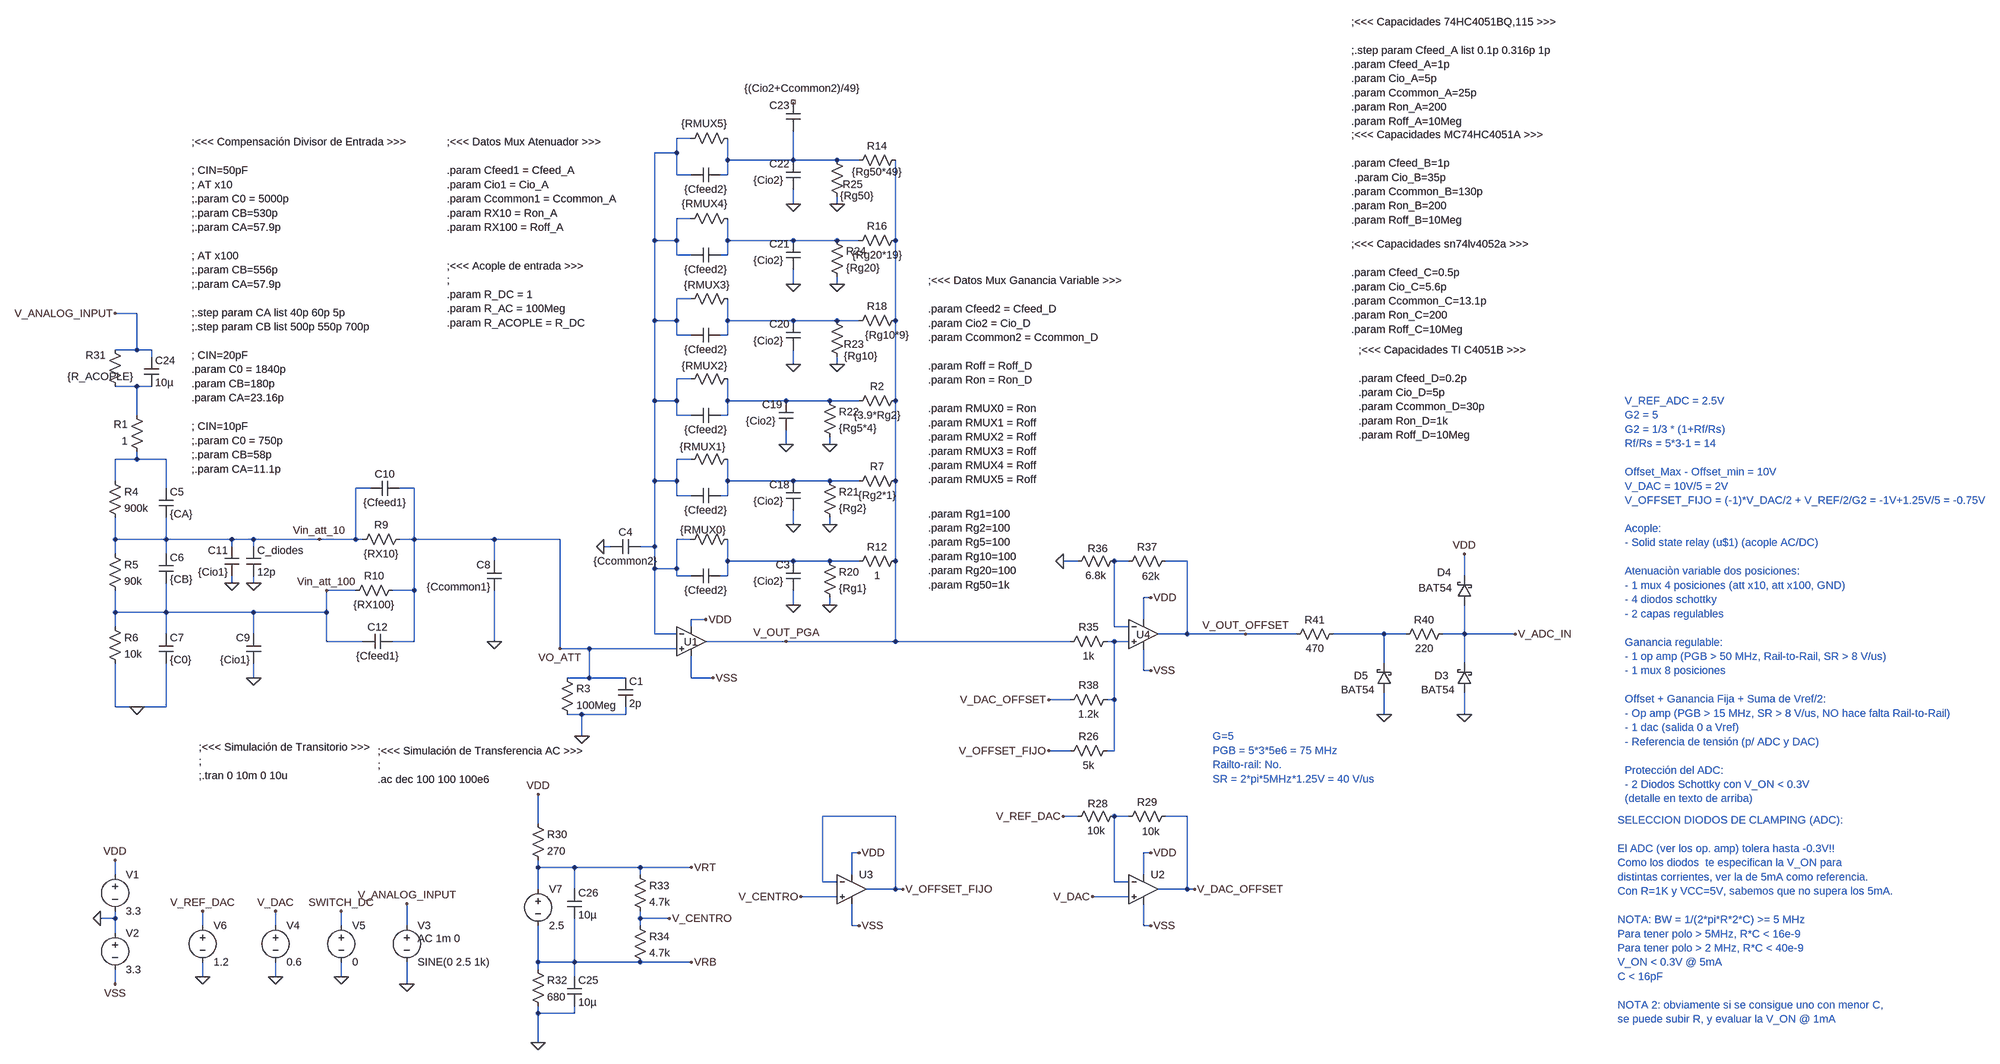
[diagram p0: schematic input_stage_complete.asc]
input_stage_complete.asc, the LTspice schematic file:
Version 4
SHEET 1 3268 1916
WIRE -32 -544 -64 -544
WIRE -64 -512 -64 -544
WIRE -64 -512 -112 -512
WIRE 48 -496 48 -544
WIRE 192 -496 192 -560
WIRE 192 -496 48 -496
WIRE 288 -496 192 -496
WIRE 336 -496 288 -496
WIRE -64 -464 -64 -512
WIRE -32 -464 -64 -464
WIRE 48 -464 48 -496
WIRE 48 -464 32 -464
WIRE 192 -400 192 -432
WIRE 288 -400 288 -416
WIRE -32 -368 -64 -368
WIRE -112 -320 -112 -512
WIRE -64 -320 -64 -368
WIRE -64 -320 -112 -320
WIRE 48 -320 48 -368
WIRE 192 -320 48 -320
WIRE 288 -320 192 -320
WIRE 336 -320 288 -320
WIRE 416 -320 416 -496
WIRE -64 -288 -64 -320
WIRE -32 -288 -64 -288
WIRE 48 -288 48 -320
WIRE 48 -288 32 -288
WIRE 192 -224 192 -256
WIRE 288 -224 288 -240
WIRE -32 -192 -64 -192
WIRE -1248 -160 -1296 -160
WIRE -112 -144 -112 -320
WIRE -64 -144 -64 -192
WIRE -64 -144 -112 -144
WIRE 48 -144 48 -192
WIRE 192 -144 48 -144
WIRE 288 -144 192 -144
WIRE 336 -144 288 -144
WIRE 416 -144 416 -320
WIRE -64 -112 -64 -144
WIRE -32 -112 -64 -112
WIRE 48 -112 48 -144
WIRE 48 -112 32 -112
WIRE -1248 -80 -1248 -160
WIRE -1248 -80 -1296 -80
WIRE -1216 -80 -1248 -80
WIRE -1216 -64 -1216 -80
WIRE 192 -48 192 -80
WIRE 288 -48 288 -64
WIRE -32 -16 -64 -16
WIRE -1248 0 -1296 0
WIRE -1216 0 -1248 0
WIRE -112 32 -112 -144
WIRE -64 32 -64 -16
WIRE -64 32 -112 32
WIRE 48 32 48 -16
WIRE 176 32 48 32
WIRE 272 32 176 32
WIRE 336 32 272 32
WIRE 416 32 416 -144
WIRE -1248 64 -1248 0
WIRE -64 64 -64 32
WIRE -32 64 -64 64
WIRE 48 64 48 32
WIRE 48 64 32 64
WIRE 176 128 176 96
WIRE 272 128 272 112
WIRE -1248 160 -1248 144
WIRE -1248 160 -1296 160
WIRE -1184 160 -1248 160
WIRE -32 160 -64 160
WIRE -1296 208 -1296 160
WIRE -112 208 -112 32
WIRE -64 208 -64 160
WIRE -64 208 -112 208
WIRE 48 208 48 160
WIRE 192 208 48 208
WIRE 272 208 192 208
WIRE 336 208 272 208
WIRE 416 208 416 32
WIRE -1184 224 -1184 160
WIRE -736 224 -768 224
WIRE -640 224 -672 224
WIRE -64 240 -64 208
WIRE -32 240 -64 240
WIRE 48 240 48 208
WIRE 48 240 32 240
WIRE 192 304 192 272
WIRE 272 304 272 288
WIRE -1296 336 -1296 288
WIRE -1184 336 -1184 288
WIRE -1184 336 -1296 336
WIRE -1040 336 -1184 336
WIRE -992 336 -1040 336
WIRE -848 336 -992 336
WIRE -768 336 -768 224
WIRE -768 336 -848 336
WIRE -752 336 -768 336
WIRE -640 336 -640 224
WIRE -640 336 -672 336
WIRE -464 336 -640 336
WIRE -320 336 -464 336
WIRE -32 336 -64 336
WIRE -1040 352 -1040 336
WIRE -992 352 -992 336
WIRE -208 352 -224 352
WIRE -112 352 -112 208
WIRE -112 352 -144 352
WIRE -1296 368 -1296 336
WIRE -1184 368 -1184 336
WIRE -464 384 -464 336
WIRE 48 384 48 336
WIRE 192 384 48 384
WIRE 272 384 192 384
WIRE 336 384 272 384
WIRE 416 384 416 208
WIRE 816 384 784 384
WIRE 928 384 896 384
WIRE 1056 384 1008 384
WIRE -112 400 -112 352
WIRE -64 400 -64 336
WIRE -64 400 -112 400
WIRE -64 416 -64 400
WIRE -32 416 -64 416
WIRE 48 416 48 384
WIRE 48 416 32 416
WIRE 1664 416 1664 368
WIRE -1040 432 -1040 416
WIRE -992 432 -992 416
WIRE -768 448 -832 448
WIRE -640 448 -640 336
WIRE -640 448 -688 448
WIRE 976 464 960 464
WIRE 192 480 192 448
WIRE 272 480 272 464
WIRE -1296 496 -1296 448
WIRE -1184 496 -1184 432
WIRE -1184 496 -1296 496
WIRE -992 496 -1184 496
WIRE -832 496 -832 448
WIRE -832 496 -992 496
WIRE 0 512 -32 512
WIRE 960 512 960 464
WIRE -1296 528 -1296 496
WIRE -32 528 -32 512
WIRE 896 528 896 384
WIRE 928 528 896 528
WIRE -1184 544 -1184 496
WIRE -992 544 -992 496
WIRE -112 544 -112 400
WIRE -64 544 -112 544
WIRE 1056 544 1056 384
WIRE 1056 544 992 544
WIRE 1184 544 1056 544
WIRE 1296 544 1184 544
WIRE 1488 544 1376 544
WIRE 1536 544 1488 544
WIRE 1664 544 1664 480
WIRE 1664 544 1616 544
WIRE 1776 544 1664 544
WIRE -832 560 -832 496
WIRE -752 560 -832 560
WIRE -640 560 -640 448
WIRE -640 560 -688 560
WIRE -464 560 -464 448
WIRE 176 560 0 560
WIRE 416 560 416 384
WIRE 416 560 176 560
WIRE 800 560 416 560
WIRE 896 560 880 560
WIRE 928 560 896 560
WIRE -320 576 -320 336
WIRE -256 576 -320 576
WIRE -64 576 -256 576
WIRE 1488 608 1488 544
WIRE 1664 608 1664 544
WIRE 960 624 960 576
WIRE 976 624 960 624
WIRE -992 640 -992 608
WIRE -256 640 -256 576
WIRE -256 640 -304 640
WIRE -176 640 -256 640
WIRE -32 640 -32 592
WIRE 16 640 -32 640
WIRE 800 688 752 688
WIRE 896 688 896 560
WIRE 896 688 880 688
WIRE -1296 704 -1296 608
WIRE -1248 704 -1296 704
WIRE -1184 704 -1184 608
WIRE -1184 704 -1248 704
WIRE -272 720 -304 720
WIRE -176 720 -176 704
WIRE -176 720 -272 720
WIRE 1488 720 1488 672
WIRE 1664 720 1664 672
WIRE -272 768 -272 720
WIRE 800 800 752 800
WIRE 896 800 896 688
WIRE 896 800 880 800
WIRE 416 944 256 944
WIRE 816 944 784 944
WIRE 928 944 896 944
WIRE 1056 944 1008 944
WIRE -368 960 -368 896
WIRE 336 1024 320 1024
WIRE 976 1024 960 1024
WIRE -368 1056 -368 1040
WIRE -288 1056 -368 1056
WIRE -144 1056 -288 1056
WIRE -32 1056 -144 1056
WIRE -1296 1072 -1296 1040
WIRE -144 1072 -144 1056
WIRE 320 1072 320 1024
WIRE 960 1072 960 1024
WIRE 256 1088 256 944
WIRE 288 1088 256 1088
WIRE 896 1088 896 944
WIRE 928 1088 896 1088
WIRE -368 1104 -368 1056
WIRE -288 1104 -288 1056
WIRE 416 1104 416 944
WIRE 416 1104 352 1104
WIRE 432 1104 416 1104
WIRE 1056 1104 1056 944
WIRE 1056 1104 992 1104
WIRE 1072 1104 1056 1104
WIRE 288 1120 208 1120
WIRE 928 1120 848 1120
WIRE -1296 1168 -1296 1152
WIRE -1296 1168 -1328 1168
WIRE -144 1168 -144 1152
WIRE -80 1168 -144 1168
WIRE -1104 1184 -1104 1152
WIRE -944 1184 -944 1152
WIRE -800 1184 -800 1152
WIRE -656 1184 -656 1136
WIRE -144 1184 -144 1168
WIRE 320 1184 320 1136
WIRE 336 1184 320 1184
WIRE 960 1184 960 1136
WIRE 976 1184 960 1184
WIRE -1296 1200 -1296 1168
WIRE -368 1264 -368 1184
WIRE -288 1264 -288 1168
WIRE -288 1264 -368 1264
WIRE -144 1264 -288 1264
WIRE -32 1264 -144 1264
WIRE -368 1280 -368 1264
WIRE -1104 1296 -1104 1264
WIRE -944 1296 -944 1264
WIRE -800 1296 -800 1264
WIRE -288 1296 -288 1264
WIRE -1296 1312 -1296 1280
WIRE -656 1312 -656 1264
WIRE -368 1376 -368 1360
WIRE -288 1376 -288 1360
WIRE -288 1376 -368 1376
WIRE -368 1440 -368 1376
FLAG 16 640 VSS
FLAG -272 768 0
FLAG 272 480 0
FLAG 0 512 VDD
FLAG -1328 1168 0
FLAG -1296 1040 VDD
FLAG -1296 1312 VSS
FLAG -656 1136 V_ANALOG_INPUT
FLAG -656 1312 0
FLAG 176 560 V_OUT_PGA
FLAG -224 352 0
FLAG 192 480 0
FLAG -1248 704 0
FLAG -1296 -160 V_ANALOG_INPUT
FLAG -464 560 0
FLAG -1040 432 0
FLAG -848 336 Vin_att_10
FLAG -832 448 Vin_att_100
FLAG -992 640 0
FLAG -320 576 VO_ATT
FLAG -992 432 0
FLAG 272 304 0
FLAG 272 128 0
FLAG 288 -48 0
FLAG 288 -224 0
FLAG 288 -400 0
FLAG 192 304 0
FLAG 176 128 0
FLAG 192 -48 0
FLAG 192 -224 0
FLAG 192 -400 0
FLAG -944 1152 V_DAC
FLAG -944 1296 0
FLAG -800 1152 SWITCH_DC
FLAG -800 1296 0
FLAG -1104 1152 V_REF_DAC
FLAG -1104 1296 0
FLAG 752 688 V_DAC_OFFSET
FLAG 976 464 VDD
FLAG 976 624 VSS
FLAG 1072 1104 V_DAC_OFFSET
FLAG 976 1024 VDD
FLAG 976 1184 VSS
FLAG 784 944 V_REF_DAC
FLAG 752 800 V_OFFSET_FIJO
FLAG 784 384 0
FLAG 848 1120 V_DAC
FLAG -368 896 VDD
FLAG 432 1104 V_OFFSET_FIJO
FLAG 336 1024 VDD
FLAG 336 1184 VSS
FLAG -368 1440 0
FLAG -32 1264 VRB
FLAG -32 1056 VRT
FLAG 208 1120 V_CENTRO
FLAG -80 1168 V_CENTRO
FLAG 1184 544 V_OUT_OFFSET
FLAG 1664 368 VDD
FLAG 1664 720 0
FLAG 1776 544 V_ADC_IN
FLAG 1488 720 0
SYMBOL res 432 16 R90
WINDOW 0 0 56 VBottom 2
WINDOW 3 32 56 VTop 2
SYMATTR InstName R2
SYMATTR Value {3.9*Rg2}
SYMBOL cap -192 640 R0
SYMATTR InstName C1
SYMATTR Value 2p
SYMBOL res -320 624 R0
SYMATTR InstName R3
SYMATTR Value 100Meg
SYMBOL voltage -1296 1056 R0
WINDOW 123 0 0 Left 2
WINDOW 39 0 0 Left 2
SYMATTR InstName V1
SYMATTR Value 3.3
SYMBOL voltage -1296 1184 R0
WINDOW 123 0 0 Left 2
WINDOW 39 0 0 Left 2
SYMATTR InstName V2
SYMATTR Value 3.3
SYMBOL voltage -656 1168 R0
WINDOW 123 24 44 Left 2
WINDOW 39 0 0 Left 2
SYMATTR Value2 AC 1m 0
SYMATTR InstName V3
SYMATTR Value SINE(0 2.5 1k)
SYMBOL Opamps\\UniversalOpamp2 -32 560 R0
WINDOW 0 -16 1 Left 2
SYMATTR InstName U1
SYMATTR Value2 Avol=40k GBW=250Meg Slew=100Meg
SYMBOL cap 32 48 R90
WINDOW 0 0 32 Invisible 2
WINDOW 3 32 32 VTop 2
SYMATTR InstName C2
SYMATTR Value {Cfeed2}
SYMBOL cap -144 336 R90
WINDOW 0 0 32 VBottom 2
WINDOW 3 32 32 VTop 2
SYMATTR InstName C4
SYMATTR Value {Ccommon2}
SYMBOL cap 208 448 R180
WINDOW 0 24 56 Left 2
WINDOW 3 38 20 Left 2
SYMATTR InstName C3
SYMATTR Value {Cio2}
SYMBOL res -1312 192 R0
SYMATTR InstName R4
SYMATTR Value 900k
SYMBOL res -1312 352 R0
SYMATTR InstName R5
SYMATTR Value 90k
SYMBOL res -1312 512 R0
SYMATTR InstName R6
SYMATTR Value 10k
SYMBOL cap -1200 224 R0
SYMATTR InstName C5
SYMATTR Value {CA}
SYMBOL cap -1200 368 R0
SYMATTR InstName C6
SYMATTR Value {CB}
SYMBOL cap -1200 544 R0
SYMATTR InstName C7
SYMATTR Value {C0}
SYMBOL res 64 -32 R90
WINDOW 0 0 56 Invisible 2
WINDOW 3 -28 67 VTop 2
SYMATTR InstName R8
SYMATTR Value {RMUX2}
SYMBOL cap -448 448 R180
WINDOW 0 24 56 Left 2
WINDOW 3 24 8 Left 2
SYMATTR InstName C8
SYMATTR Value {Ccommon1}
SYMBOL cap -672 208 R90
WINDOW 0 0 32 VBottom 2
WINDOW 3 32 32 VTop 2
SYMATTR InstName C10
SYMATTR Value {Cfeed1}
SYMBOL cap -1024 416 R180
WINDOW 0 24 56 Left 2
WINDOW 3 24 8 Left 2
SYMATTR InstName C11
SYMATTR Value {Cio1}
SYMBOL cap -976 608 R180
WINDOW 0 24 56 Left 2
WINDOW 3 24 8 Left 2
SYMATTR InstName C9
SYMATTR Value {Cio1}
SYMBOL res -656 320 R90
WINDOW 0 0 56 VBottom 2
WINDOW 3 32 56 VTop 2
SYMATTR InstName R9
SYMATTR Value {RX10}
SYMBOL res -672 432 R90
WINDOW 0 0 56 VBottom 2
WINDOW 3 32 56 VTop 2
SYMATTR InstName R10
SYMATTR Value {RX100}
SYMBOL cap -688 544 R90
WINDOW 0 0 32 VBottom 2
WINDOW 3 32 32 VTop 2
SYMATTR InstName C12
SYMATTR Value {Cfeed1}
SYMBOL res 432 192 R90
WINDOW 0 0 56 VBottom 2
WINDOW 3 32 56 VTop 2
SYMATTR InstName R7
SYMATTR Value {Rg2*1}
SYMBOL cap 32 224 R90
WINDOW 0 0 32 Invisible 2
WINDOW 3 32 32 VTop 2
SYMATTR InstName C13
SYMATTR Value {Cfeed2}
SYMBOL res 64 144 R90
WINDOW 0 0 56 Invisible 2
WINDOW 3 -27 71 VTop 2
SYMATTR InstName R11
SYMATTR Value {RMUX1}
SYMBOL res 432 368 R90
WINDOW 0 0 56 VBottom 2
WINDOW 3 32 56 VTop 2
SYMATTR InstName R12
SYMATTR Value 1
SYMBOL cap 32 400 R90
WINDOW 0 0 32 Invisible 2
WINDOW 3 32 32 VTop 2
SYMATTR InstName C14
SYMATTR Value {Cfeed2}
SYMBOL res 64 320 R90
WINDOW 0 0 56 Invisible 2
WINDOW 3 -20 70 VTop 2
SYMATTR InstName R13
SYMATTR Value {RMUX0}
SYMBOL res 432 -512 R90
WINDOW 0 0 56 VBottom 2
WINDOW 3 26 57 VTop 2
SYMATTR InstName R14
SYMATTR Value {Rg50*49}
SYMBOL cap 32 -480 R90
WINDOW 0 0 32 Invisible 2
WINDOW 3 32 32 VTop 2
SYMATTR InstName C15
SYMATTR Value {Cfeed2}
SYMBOL res 64 -560 R90
WINDOW 0 0 56 Invisible 2
WINDOW 3 -32 68 VTop 2
SYMATTR InstName R15
SYMATTR Value {RMUX5}
SYMBOL res 432 -336 R90
WINDOW 0 0 56 VBottom 2
WINDOW 3 32 56 VTop 2
SYMATTR InstName R16
SYMATTR Value {Rg20*19}
SYMBOL cap 32 -304 R90
WINDOW 0 0 32 Invisible 2
WINDOW 3 32 32 VTop 2
SYMATTR InstName C16
SYMATTR Value {Cfeed2}
SYMBOL res 64 -384 R90
WINDOW 0 0 56 Invisible 2
WINDOW 3 -32 67 VTop 2
SYMATTR InstName R17
SYMATTR Value {RMUX4}
SYMBOL res 432 -160 R90
WINDOW 0 0 56 VBottom 2
WINDOW 3 32 34 VTop 2
SYMATTR InstName R18
SYMATTR Value {Rg10*9}
SYMBOL cap 32 -128 R90
WINDOW 0 0 32 Invisible 2
WINDOW 3 32 32 VTop 2
SYMATTR InstName C17
SYMATTR Value {Cfeed2}
SYMBOL res 64 -208 R90
WINDOW 0 0 56 Invisible 2
WINDOW 3 -30 62 VTop 2
SYMATTR InstName R19
SYMATTR Value {RMUX3}
SYMBOL cap -1008 352 R0
SYMATTR InstName C_diodes
SYMATTR Value 12p
SYMBOL res 256 368 R0
SYMATTR InstName R20
SYMATTR Value {Rg1}
SYMBOL res 256 192 R0
SYMATTR InstName R21
SYMATTR Value {Rg2}
SYMBOL res 256 16 R0
SYMATTR InstName R22
SYMATTR Value {Rg5*4}
SYMBOL res 272 -160 R0
WINDOW 0 31 68 Left 2
WINDOW 3 31 94 Left 2
SYMATTR InstName R23
SYMATTR Value {Rg10}
SYMBOL res 272 -336 R0
SYMATTR InstName R24
SYMATTR Value {Rg20}
SYMBOL res 272 -512 R0
WINDOW 0 28 69 Left 2
WINDOW 3 22 94 Left 2
SYMATTR InstName R25
SYMATTR Value {Rg50}
SYMBOL cap 208 272 R180
WINDOW 0 24 56 Left 2
WINDOW 3 38 20 Left 2
SYMATTR InstName C18
SYMATTR Value {Cio2}
SYMBOL cap 192 96 R180
WINDOW 0 24 56 Left 2
WINDOW 3 38 20 Left 2
SYMATTR InstName C19
SYMATTR Value {Cio2}
SYMBOL cap 208 -80 R180
WINDOW 0 24 56 Left 2
WINDOW 3 38 20 Left 2
SYMATTR InstName C20
SYMATTR Value {Cio2}
SYMBOL cap 208 -256 R180
WINDOW 0 24 56 Left 2
WINDOW 3 38 20 Left 2
SYMATTR InstName C21
SYMATTR Value {Cio2}
SYMBOL cap 208 -432 R180
WINDOW 0 24 56 Left 2
WINDOW 3 38 20 Left 2
SYMATTR InstName C22
SYMATTR Value {Cio2}
SYMBOL cap 208 -560 R180
WINDOW 0 24 56 Left 2
WINDOW 3 -131 94 Left 2
SYMATTR InstName C23
SYMATTR Value {(Cio2+Ccommon2)/49}
SYMBOL res -1232 160 R180
WINDOW 0 36 76 Left 2
WINDOW 3 36 40 Left 2
SYMATTR InstName R1
SYMATTR Value 1
SYMBOL voltage -944 1168 R0
WINDOW 123 0 0 Left 2
WINDOW 39 0 0 Left 2
SYMATTR InstName V4
SYMATTR Value 0.6
SYMBOL voltage -800 1168 R0
WINDOW 123 0 0 Left 2
WINDOW 39 0 0 Left 2
SYMATTR InstName V5
SYMATTR Value 0
SYMBOL voltage -1104 1168 R0
WINDOW 123 0 0 Left 2
WINDOW 39 0 0 Left 2
SYMATTR InstName V6
SYMATTR Value 1.2
SYMBOL cap -1232 -64 R0
SYMATTR InstName C24
SYMATTR Value 10µ
SYMBOL res -1312 -96 R0
WINDOW 0 -49 28 Left 2
WINDOW 3 -89 75 Left 2
SYMATTR InstName R31
SYMATTR Value {R_ACOPLE}
SYMBOL res 784 576 R270
WINDOW 0 32 56 VTop 2
WINDOW 3 0 56 VBottom 2
SYMATTR InstName R35
SYMATTR Value 1k
SYMBOL res 800 400 R270
WINDOW 0 28 60 VTop 2
WINDOW 3 0 56 VBottom 2
SYMATTR InstName R36
SYMATTR Value 6.8k
SYMBOL res 912 400 R270
WINDOW 0 32 56 VTop 2
WINDOW 3 -1 64 VBottom 2
SYMATTR InstName R37
SYMATTR Value 62k
SYMBOL res 784 704 R270
WINDOW 0 32 56 VTop 2
WINDOW 3 0 56 VBottom 2
SYMATTR InstName R38
SYMATTR Value 1.2k
SYMBOL res 800 960 R270
WINDOW 0 28 60 VTop 2
WINDOW 3 0 56 VBottom 2
SYMATTR InstName R28
SYMATTR Value 10k
SYMBOL res 912 960 R270
WINDOW 0 32 56 VTop 2
WINDOW 3 -1 64 VBottom 2
SYMATTR InstName R29
SYMATTR Value 10k
SYMBOL Opamps\\UniversalOpamp2 960 1104 R0
SYMATTR InstName U2
SYMBOL res 784 816 R270
WINDOW 0 32 56 VTop 2
WINDOW 3 0 56 VBottom 2
SYMATTR InstName R26
SYMATTR Value 5k
SYMBOL Opamps\\UniversalOpamp2 320 1104 R0
SYMATTR InstName U3
SYMBOL res -384 944 R0
SYMATTR InstName R30
SYMATTR Value 270
SYMBOL voltage -368 1088 R0
WINDOW 123 0 0 Left 2
WINDOW 39 0 0 Left 2
SYMATTR InstName V7
SYMATTR Value 2.5
SYMBOL res -384 1264 R0
SYMATTR InstName R32
SYMATTR Value 680
SYMBOL cap -304 1296 R0
SYMATTR InstName C25
SYMATTR Value 10µ
SYMBOL cap -304 1104 R0
SYMATTR InstName C26
SYMATTR Value 10µ
SYMBOL res -160 1056 R0
SYMATTR InstName R33
SYMATTR Value 4.7k
SYMBOL res -160 1168 R0
SYMATTR InstName R34
SYMATTR Value 4.7k
SYMBOL Opamps\\UniversalOpamp2 960 544 R0
WINDOW 0 -16 1 Left 2
SYMATTR InstName U4
SYMATTR Value2 Avol=40k GBW=250Meg Slew=100Meg
SYMBOL res 1520 560 R270
WINDOW 0 32 56 VTop 2
WINDOW 3 0 56 VBottom 2
SYMATTR InstName R40
SYMATTR Value 220
SYMBOL schottky 1680 672 R180
WINDOW 0 51 37 Left 2
WINDOW 3 37 6 Left 2
SYMATTR InstName D3
SYMATTR Value BAT54
SYMBOL schottky 1680 480 R180
WINDOW 0 45 71 Left 2
WINDOW 3 43 37 Left 2
SYMATTR InstName D4
SYMATTR Value BAT54
SYMBOL res 1280 560 R270
WINDOW 0 32 56 VTop 2
WINDOW 3 0 56 VBottom 2
SYMATTR InstName R41
SYMATTR Value 470
SYMBOL schottky 1504 672 R180
WINDOW 0 51 37 Left 2
WINDOW 3 37 6 Left 2
SYMATTR InstName D5
SYMATTR Value BAT54
TEXT 1416 -312 Left 2 !;<<< Capacidades sn74lv4052a >>>\n \n.param Cfeed_C=0.5p\n.param Cio_C=5.6p\n.param Ccommon_C=13.1p\n.param Ron_C=200\n.param Roff_C=10Meg
TEXT -568 -536 Left 2 !;<<< Datos Mux Atenuador >>>\n \n.param Cfeed1 = Cfeed_A\n.param Cio1 = Cio_A\n.param Ccommon1 = Ccommon_A\n.param RX10 = Ron_A\n.param RX100 = Roff_A
TEXT 1416 -552 Left 2 !;<<< Capacidades MC74HC4051A >>>\n \n.param Cfeed_B=1p\n .param Cio_B=35p\n.param Ccommon_B=130p\n.param Ron_B=200\n.param Roff_B=10Meg
TEXT 488 -232 Left 2 !;<<< Datos Mux Ganancia Variable >>>\n \n.param Cfeed2 = Cfeed_D\n.param Cio2 = Cio_D\n.param Ccommon2 = Ccommon_D\n \n.param Roff = Roff_D\n.param Ron = Ron_D \n \n.param RMUX0 = Ron\n.param RMUX1 = Roff\n.param RMUX2 = Roff\n.param RMUX3 = Roff\n.param RMUX4 = Roff\n.param RMUX5 = Roff
TEXT -720 800 Left 2 !;<<< Simulación de Transferencia AC >>>\n;\n.ac dec 100 100 100e6
TEXT 1416 -800 Left 2 !;<<< Capacidades 74HC4051BQ,115 >>>\n \n;.step param Cfeed_A list 0.1p 0.316p 1p\n.param Cfeed_A=1p\n.param Cio_A=5p\n.param Ccommon_A=25p\n.param Ron_A=200\n.param Roff_A=10Meg
TEXT 1432 -80 Left 2 !;<<< Capacidades TI C4051B >>>\n \n.param Cfeed_D=0.2p\n.param Cio_D=5p\n.param Ccommon_D=30p\n.param Ron_D=1k\n.param Roff_D=10Meg
TEXT 488 280 Left 2 !.param Rg1=100\n.param Rg2=100\n.param Rg5=100\n.param Rg10=100\n.param Rg20=100\n.param Rg50=1k
TEXT -1128 -536 Left 2 !;<<< Compensación Divisor de Entrada >>>\n \n; CIN=50pF\n; AT x10\n;.param C0 = 5000p\n;.param CB=530p\n;.param CA=57.9p\n \n; AT x100\n;.param CB=556p\n;.param CA=57.9p\n \n;.step param CA list 40p 60p 5p\n;.step param CB list 500p 550p 700p\n \n; CIN=20pF\n.param C0 = 1840p\n.param CB=180p\n.param CA=23.16p\n \n; CIN=10pF\n;.param C0 = 750p\n;.param CB=58p\n;.param CA=11.1p
TEXT -1112 792 Left 2 !;<<< Simulación de Transitorio >>>\n;\n;.tran 0 10m 0 10u
TEXT 2000 952 Left 2 ;SELECCION DIODOS DE CLAMPING (ADC):\n \nEl ADC (ver los op. amp) tolera hasta -0.3V!!\nComo los diodos  te especifican la V_ON para\ndistintas corrientes, ver la de 5mA como referencia.\nCon R=1K y VCC=5V, sabemos que no supera los 5mA.\n \nNOTA: BW = 1/(2*pi*R*2*C) >= 5 MHz\nPara tener polo > 5MHz, R*C < 16e-9\nPara tener polo > 2 MHz, R*C < 40e-9\nV_ON < 0.3V @ 5mA\nC < 16pF\n \nNOTA 2: obviamente si se consigue uno con menor C,\nse puede subir R, y evaluar la V_ON @ 1mA
TEXT 1112 768 Left 2 ;G=5\nPGB = 5*3*5e6 = 75 MHz\nRailto-rail: No.\nSR = 2*pi*5MHz*1.25V = 40 V/us
TEXT 2016 312 Left 2 ;Acople:\n- Solid state relay (u$1) (acople AC/DC)\n \nAtenuaciòn variable dos posiciones:\n- 1 mux 4 posiciones (att x10, att x100, GND)\n- 4 diodos schottky\n- 2 capas regulables\n \nGanancia regulable:\n- 1 op amp (PGB > 50 MHz, Rail-to-Rail, SR > 8 V/us)\n- 1 mux 8 posiciones\n \nOffset + Ganancia Fija + Suma de Vref/2:\n- Op amp (PGB > 15 MHz, SR > 8 V/us, NO hace falta Rail-to-Rail)\n- 1 dac (salida 0 a Vref)\n- Referencia de tensión (p/ ADC y DAC)\n \nProtección del ADC:\n- 2 Diodos Schottky con V_ON < 0.3V\n(detalle en texto de arriba)
TEXT -568 -264 Left 2 !;<<< Acople de entrada >>>\n;\n.param R_DC = 1\n.param R_AC = 100Meg\n.param R_ACOPLE = R_DC
TEXT 2016 32 Left 2 ;V_REF_ADC = 2.5V\nG2 = 5\nG2 = 1/3 * (1+Rf/Rs)\nRf/Rs = 5*3-1 = 14\n \nOffset_Max - Offset_min = 10V\nV_DAC = 10V/5 = 2V\nV_OFFSET_FIJO = (-1)*V_DAC/2 + V_REF/2/G2 = -1V+1.25V/5 = -0.75V

The netlist it stands for:
* input_stage_complete.asc
R2 V_OUT_PGA N006 {3.9*Rg2}
C1 VO_ATT 0 2p
R3 VO_ATT 0 100Meg
V1 VDD 0 3.3
V2 0 VSS 3.3
V3 V_ANALOG_INPUT 0 SINE(0 2.5 1k) AC 1m 0
XU1 VO_ATT N001 VDD VSS V_OUT_PGA level.2 Avol=40k GBW=250Meg Slew=100Meg ilimit=25m rail=0 Vos=0 phimargin=45 en=0 enk=0 in=0 ink=0 Rin=500Meg  ; pins IN+ IN- V+ V- OUT
C2 N006 N001 {Cfeed2}
C4 N001 0 {Ccommon2}
C3 0 N009 {Cio2}
R4 N007 Vin_att_10 900k
R5 Vin_att_10 Vin_att_100 90k
R6 Vin_att_100 0 10k
C5 N007 Vin_att_10 {CA}
C6 Vin_att_10 Vin_att_100 {CB}
C7 Vin_att_100 0 {C0}
R8 N006 N001 {RMUX2}
C8 0 VO_ATT {Ccommon1}
C10 VO_ATT Vin_att_10 {Cfeed1}
C11 0 Vin_att_10 {Cio1}
C9 0 Vin_att_100 {Cio1}
R9 VO_ATT Vin_att_10 {RX10}
R10 VO_ATT Vin_att_100 {RX100}
C12 VO_ATT Vin_att_100 {Cfeed1}
R7 V_OUT_PGA N008 {Rg2*1}
C13 N008 N001 {Cfeed2}
R11 N008 N001 {RMUX1}
R12 V_OUT_PGA N009 1
C14 N009 N001 {Cfeed2}
R13 N009 N001 {RMUX0}
R14 V_OUT_PGA N002 {Rg50*49}
C15 N002 N001 {Cfeed2}
R15 N002 N001 {RMUX5}
R16 V_OUT_PGA N003 {Rg20*19}
C16 N003 N001 {Cfeed2}
R17 N003 N001 {RMUX4}
R18 V_OUT_PGA N004 {Rg10*9}
C17 N004 N001 {Cfeed2}
R19 N004 N001 {RMUX3}
C_diodes Vin_att_10 0 12p
R20 N009 0 {Rg1}
R21 N008 0 {Rg2}
R22 N006 0 {Rg5*4}
R23 N004 0 {Rg10}
R24 N003 0 {Rg20}
R25 N002 0 {Rg50}
C18 0 N008 {Cio2}
C19 0 N006 {Cio2}
C20 0 N004 {Cio2}
C21 0 N003 {Cio2}
C22 0 N002 {Cio2}
C23 N002 NC_01 {(Cio2+Ccommon2)/49}
R1 N007 N005 1
V4 V_DAC 0 0.6
V5 SWITCH_DC 0 0
V6 V_REF_DAC 0 1.2
C24 V_ANALOG_INPUT N005 10µ
R31 V_ANALOG_INPUT N005 {R_ACOPLE}
R35 V_OUT_PGA N012 1k
R36 0 N010 6.8k
R37 N010 V_OUT_OFFSET 62k
R38 V_DAC_OFFSET N012 1.2k
R28 V_REF_DAC N013 10k
R29 N013 V_DAC_OFFSET 10k
XU2 V_DAC N013 VDD VSS V_DAC_OFFSET level.2 Avol=1Meg GBW=10Meg Slew=10Meg ilimit=25m rail=0 Vos=0 phimargin=45 en=0 enk=0 in=0 ink=0 Rin=500Meg  ; pins IN+ IN- V+ V- OUT
R26 V_OFFSET_FIJO N012 5k
XU3 V_CENTRO V_OFFSET_FIJO VDD VSS V_OFFSET_FIJO level.2 Avol=1Meg GBW=10Meg Slew=10Meg ilimit=25m rail=0 Vos=0 phimargin=45 en=0 enk=0 in=0 ink=0 Rin=500Meg  ; pins IN+ IN- V+ V- OUT
R30 VDD VRT 270
V7 VRT VRB 2.5
R32 VRB 0 680
C25 VRB 0 10µ
C26 VRT VRB 10µ
R33 VRT V_CENTRO 4.7k
R34 V_CENTRO VRB 4.7k
XU4 N012 N010 VDD VSS V_OUT_OFFSET level.2 Avol=40k GBW=250Meg Slew=100Meg ilimit=25m rail=0 Vos=0 phimargin=45 en=0 enk=0 in=0 ink=0 Rin=500Meg  ; pins IN+ IN- V+ V- OUT
R40 N011 V_ADC_IN 220
D3 0 V_ADC_IN BAT54
D4 V_ADC_IN VDD BAT54
R41 V_OUT_OFFSET N011 470
D5 0 N011 BAT54
.model D D
.lib standard.dio
;<<< Capacidades sn74lv4052a >>>
.param Cfeed_C=0.5p
.param Cio_C=5.6p
.param Ccommon_C=13.1p
.param Ron_C=200
.param Roff_C=10Meg
;<<< Datos Mux Atenuador >>>
.param Cfeed1 = Cfeed_A
.param Cio1 = Cio_A
.param Ccommon1 = Ccommon_A
.param RX10 = Ron_A
.param RX100 = Roff_A
;<<< Capacidades MC74HC4051A >>>
.param Cfeed_B=1p
 .param Cio_B=35p
.param Ccommon_B=130p
.param Ron_B=200
.param Roff_B=10Meg
;<<< Datos Mux Ganancia Variable >>>
.param Cfeed2 = Cfeed_D
.param Cio2 = Cio_D
.param Ccommon2 = Ccommon_D
.param Roff = Roff_D
.param Ron = Ron_D
.param RMUX0 = Ron
.param RMUX1 = Roff
.param RMUX2 = Roff
.param RMUX3 = Roff
.param RMUX4 = Roff
.param RMUX5 = Roff
;<<< Simulación de Transferencia AC >>>
;
.ac dec 100 100 100e6
;<<< Capacidades 74HC4051BQ,115 >>>
;.step param Cfeed_A list 0.1p 0.316p 1p
.param Cfeed_A=1p
.param Cio_A=5p
.param Ccommon_A=25p
.param Ron_A=200
.param Roff_A=10Meg
;<<< Capacidades TI C4051B >>>
.param Cfeed_D=0.2p
.param Cio_D=5p
.param Ccommon_D=30p
.param Ron_D=1k
.param Roff_D=10Meg
.param Rg1=100
.param Rg2=100
.param Rg5=100
.param Rg10=100
.param Rg20=100
.param Rg50=1k
;<<< Compensación Divisor de Entrada >>>
; CIN=50pF
; AT x10
;.param C0 = 5000p
;.param CB=530p
;.param CA=57.9p
; AT x100
;.param CB=556p
;.param CA=57.9p
;.step param CA list 40p 60p 5p
;.step param CB list 500p 550p 700p
; CIN=20pF
.param C0 = 1840p
.param CB=180p
.param CA=23.16p
; CIN=10pF
;.param C0 = 750p
;.param CB=58p
;.param CA=11.1p
;<<< Simulación de Transitorio >>>
;
;.tran 0 10m 0 10u
* SELECCION DIODOS DE CLAMPING (ADC):
* El ADC (ver los op. amp) tolera hasta -0.3V!!
* Como los diodos  te especifican la V_ON para
* distintas corrientes, ver la de 5mA como referencia.
* Con R=1K y VCC=5V, sabemos que no supera los 5mA.
* NOTA: BW = 1/(2*pi*R*2*C) >= 5 MHz
* Para tener polo > 5MHz, R*C < 16e-9
* Para tener polo > 2 MHz, R*C < 40e-9
* V_ON < 0.3V @ 5mA
* C < 16pF
* NOTA 2: obviamente si se consigue uno con menor C,
* se puede subir R, y evaluar la V_ON @ 1mA
* G=5
* PGB = 5*3*5e6 = 75 MHz
* Railto-rail: No.
* SR = 2*pi*5MHz*1.25V = 40 V/us
* Acople:
* - Solid state relay (u$1) (acople AC/DC)
* Atenuaciòn variable dos posiciones:
* - 1 mux 4 posiciones (att x10, att x100, GND)
* - 4 diodos schottky
* - 2 capas regulables
* Ganancia regulable:
* - 1 op amp (PGB > 50 MHz, Rail-to-Rail, SR > 8 V/us)
* - 1 mux 8 posiciones
* Offset + Ganancia Fija + Suma de Vref/2:
* - Op amp (PGB > 15 MHz, SR > 8 V/us, NO hace falta Rail-to-Rail)
* - 1 dac (salida 0 a Vref)
* - Referencia de tensión (p/ ADC y DAC)
* Protección del ADC:
* - 2 Diodos Schottky con V_ON < 0.3V
* (detalle en texto de arriba)
;<<< Acople de entrada >>>
;
.param R_DC = 1
.param R_AC = 100Meg
.param R_ACOPLE = R_DC
* V_REF_ADC = 2.5V
* G2 = 5
* G2 = 1/3 * (1+Rf/Rs)
* Rf/Rs = 5*3-1 = 14
* Offset_Max - Offset_min = 10V
* V_DAC = 10V/5 = 2V
* V_OFFSET_FIJO = (-1)*V_DAC/2 + V_REF/2/G2 = -1V+1.25V/5 = -0.75V
.lib UniversalOpamps2.sub
.backanno
.end